# Altium schematic sheet Power.SchDoc
size A
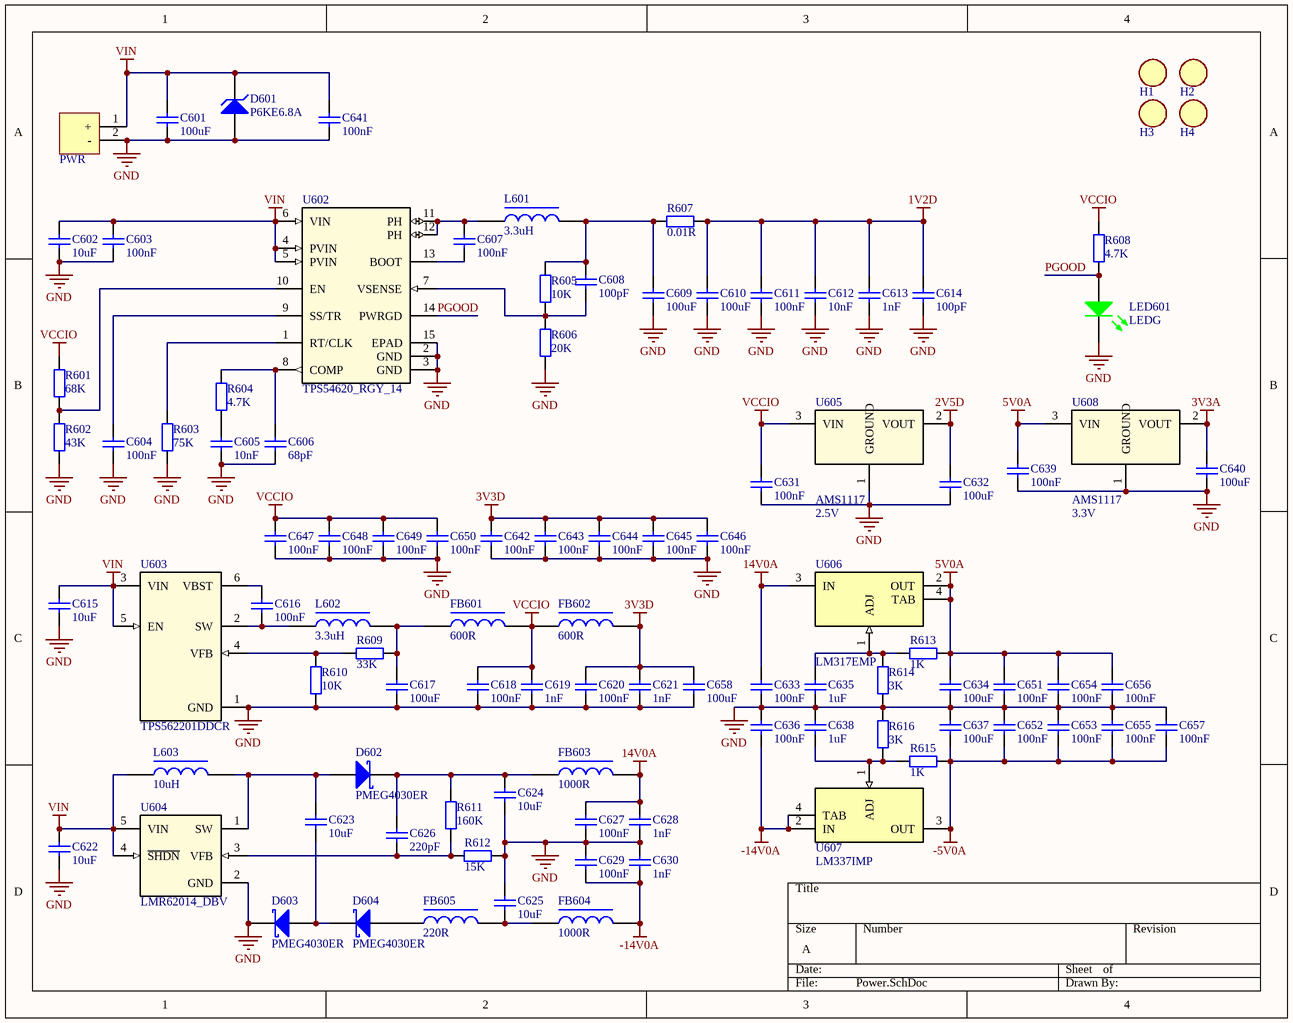
[diagram p0: Power.SchDoc]

## Parts
C601  value 100uF  [1210C]  (hidden comment: MLCC)
C602  value 10uF  [1206C]  (hidden comment: MLCC)
C603  value 100nF  [0603C]  (hidden comment: MLCC)
C604  value 100nF  [0603C]  (hidden comment: MLCC)
C605  value 10nF  [0603C]  (hidden comment: MLCC)
C606  value 68pF  [0603C]  (hidden comment: MLCC)
C607  value 100nF  [0603C]  (hidden comment: MLCC)
C608  value 100pF  [0603C]  (hidden comment: MLCC)
C609  value 100uF  [1206C]  (hidden comment: MLCC)
C610  value 100uF  [1206C]  (hidden comment: MLCC)
C611  value 100nF  [0402C]  (hidden comment: MLCC)
C612  value 10nF  [0402C]  (hidden comment: MLCC)
C613  value 1nF  [0402C]  (hidden comment: MLCC)
C614  value 100pF  [0402C]  (hidden comment: MLCC)
C615  value 10uF  [1206C]  (hidden comment: MLCC)
C616  value 100nF  [0603C]  (hidden comment: MLCC)
C617  value 100uF  [1206C]  (hidden comment: MLCC)
C618  value 100nF  [0402C]  (hidden comment: MLCC)
C619  value 1nF  [0402C]  (hidden comment: MLCC)
C620  value 100nF  [0402C]  (hidden comment: MLCC)
C621  value 1nF  [0402C]  (hidden comment: MLCC)
C622  value 10uF  [1206C]  (hidden comment: MLCC)
C623  value 10uF  [1206C]  (hidden comment: MLCC)
C624  value 10uF  [1206C]  (hidden comment: MLCC)
C625  value 10uF  [1206C]  (hidden comment: MLCC)
C626  value 220pF  [0603C]  (hidden comment: MLCC)
C627  value 100nF  [0402C]  (hidden comment: MLCC)
C628  value 1nF  [0402C]  (hidden comment: MLCC)
C629  value 100nF  [0402C]  (hidden comment: MLCC)
C630  value 1nF  [0402C]  (hidden comment: MLCC)
C631  value 100nF  [0603C]  (hidden comment: MLCC)
C632  value 100uF  [1206C]  (hidden comment: MLCC)
C633  value 100nF  [0603C]  (hidden comment: MLCC)
C634  value 100uF  [1206C]  (hidden comment: MLCC)
C635  value 1uF  [0805C]  (hidden comment: MLCC)
C636  value 100nF  [0603C]  (hidden comment: MLCC)
C637  value 100uF  [1206C]  (hidden comment: MLCC)
C638  value 1uF  [0805C]  (hidden comment: MLCC)
C639  value 100nF  [0603C]  (hidden comment: MLCC)
C640  value 100uF  [1206C]  (hidden comment: MLCC)
C641  value 100nF  [0603C]  (hidden comment: MLCC)
C642  value 100nF  [0603C]  (hidden comment: MLCC)
C643  value 100nF  [0603C]  (hidden comment: MLCC)
C644  value 100nF  [0603C]  (hidden comment: MLCC)
C645  value 100nF  [0603C]  (hidden comment: MLCC)
C646  value 100nF  [0603C]  (hidden comment: MLCC)
C647  value 100nF  [0603C]  (hidden comment: MLCC)
C648  value 100nF  [0603C]  (hidden comment: MLCC)
C649  value 100nF  [0603C]  (hidden comment: MLCC)
C650  value 100nF  [0603C]  (hidden comment: MLCC)
C651  value 100nF  [0603C]  (hidden comment: MLCC)
C652  value 100nF  [0603C]  (hidden comment: MLCC)
C653  value 100nF  [0603C]  (hidden comment: MLCC)
C654  value 100nF  [0603C]  (hidden comment: MLCC)
C655  value 100nF  [0603C]  (hidden comment: MLCC)
C656  value 100nF  [0603C]  (hidden comment: MLCC)
C657  value 100nF  [0603C]  (hidden comment: MLCC)
C658  value 100uF  [1206C]  (hidden comment: MLCC)
D601  P6KE6.8A  [SMB]
D602  PMEG4030ER  [SOD123]
D603  PMEG4030ER  [SOD123]
D604  PMEG4030ER  [SOD123]
FB601  value 600R  [1206L]  (hidden comment: FerriteBead)
FB602  value 600R  [1206L]  (hidden comment: FerriteBead)
FB603  value 1000R  [0805L]  (hidden comment: FerriteBead)
FB604  value 1000R  [0805L]  (hidden comment: FerriteBead)
FB605  value 220R  [0805L]  (hidden comment: FerriteBead)
H1  MountHole  [MOUNTHOLE]  (value not drawn)
H2  MountHole  [MOUNTHOLE]  (value not drawn)
H3  MountHole  [MOUNTHOLE]  (value not drawn)
H4  MountHole  [MOUNTHOLE]  (value not drawn)
L601  value 3.3uH  [IND0630]  (hidden comment: PowerInductor)
L602  value 3.3uH  [IND0420]  (hidden comment: PowerInductor)
L603  value 10uH  [IND0420]  (hidden comment: PowerInductor)
LED601  LEDG  [LED1206G]
PWR  WPORT2_PWR  [VH3.96-POWER-2P]  (value not drawn)
R601  value 68K  [0603R]  (hidden comment: Resistor)
R602  value 43K  [0603R]  (hidden comment: Resistor)
R603  value 75K  [0603R]  (hidden comment: Resistor)
R604  value 4.7K  [0603R]  (hidden comment: Resistor)
R605  value 10K  [0603R]  (hidden comment: Resistor)
R606  value 20K  [0603R]  (hidden comment: Resistor)
R607  value 0.01R  [1206R]  (hidden comment: Resistor)
R608  value 4.7K  [0603R]  (hidden comment: Resistor)
R609  value 33K  [0603R]  (hidden comment: Resistor)
R610  value 10K  [0603R]  (hidden comment: Resistor)
R611  value 160K  [0603R]  (hidden comment: Resistor)
R612  value 15K  [0603R]  (hidden comment: Resistor)
R613  value 1K  [0603R]  (hidden comment: Resistor)
R614  value 3K  [0603R]  (hidden comment: Resistor)
R615  value 1K  [0603R]  (hidden comment: Resistor)
R616  value 3K  [0603R]  (hidden comment: Resistor)
U602  TPS54620_RGY_14  [RGY14_2P05X2P05]
U603  TPS562201DDCR  [DDC0006A_N]
U604  LMR62014_DBV  [MF05A_N]
U605  AMS1117  value 2.5V  [DCY4]
U606  LM317EMP  [MP04A_N]
U607  LM337IMP  [MP04A_N]
U608  AMS1117  value 3.3V  [DCY4]

## Nets
1V2D: C610.2 C611.2 C612.2 C613.2 C614.2 R607.2
2V5D: C632.2 U605.2(VOUT)
3V3A: C640.2 U608.2(VOUT)
3V3D: C620.2 C621.2 C642.2 C643.2 C644.2 C645.2 C646.2 C658.2 FB602.2
5V0A: C634.2 C639.2 C651.2 C654.2 C656.2 R613.2 U606.2(OUT) U606.4(TAB) U608.3(VIN)
14V0A: C627.2 C628.2 C633.2 FB603.2 U606.3(IN)
-5V0A: C637.1 C652.1 C653.1 C655.1 C657.1 R615.2 U607.3(OUT)
-14V0A: C629.1 C630.1 C636.1 FB604.2 U607.2(IN) U607.4(TAB)
GND: C601.1 C602.1 C603.1 C604.1 C605.1 C606.1 C609.1 C610.1 C611.1 C612.1 C613.1 C614.1 C615.1 C617.1 C618.1 C619.1 C620.1 C621.1 C622.1 C624.1 C625.2 C627.1 C628.1 C629.2 C630.2 C631.1 C632.1 C633.1 C634.1 C635.1 C636.2 C637.2 C638.2 C639.1 C640.1 C641.1 C642.1 C643.1 C644.1 C645.1 C646.1 C647.1 C648.1 C649.1 C650.1 C651.1 C652.2 C653.2 C654.1 C655.2 C656.1 C657.2 C658.1 D601.1(A) D603.2(K) LED601.2(K) PWR.2(-) R602.1 R603.1 R606.1 R610.1 R612.2 R614.1 R616.2 U602.2(GND) U602.3(GND) U602.15(EPAD) U603.1(GND) U604.2(GND) U605.1(GROUND) U608.1(GROUND)
VCCIO: C618.2 C619.2 C631.2 C647.2 C648.2 C649.2 C650.2 FB601.2 FB602.1 R601.2 R608.2 U605.3(VIN)
VIN: C601.2 C602.2 C603.2 C615.2 C622.2 C641.2 D601.2(K) L603.1 PWR.1(+) U602.4(PVIN) U602.5(PVIN) U602.6(VIN) U603.3(VIN) U603.5(EN) U604.4(~{SHDN}) U604.5(VIN)
PGOOD: LED601.1(A) R608.1 U602.14(PWRGD)
NetC604_2: C604.2 U602.9(SS/TR)
NetC605_2: C605.2 R604.1
NetC606_2: C606.2 R604.2 U602.8(COMP)
NetC607_1: C607.1 U602.13(BOOT)
NetC607_2: C607.2 L601.1 U602.11(PH) U602.12(PH)
NetC608_1: C608.1 R605.1 R606.2 U602.7(VSENSE)
NetC608_2: C608.2 C609.2 L601.2 R605.2 R607.1
NetC616_1: C616.1 L602.1 U603.2(SW)
NetC616_2: C616.2 U603.6(VBST)
NetC617_2: C617.2 FB601.1 L602.2 R609.2
NetC623_1: C623.1 D603.1(A) D604.2(K)
NetC623_2: C623.2 D602.1(A) L603.2 U604.1(SW)
NetC624_2: C624.2 C626.2 D602.2(K) FB603.1 R611.2
NetC625_1: C625.1 FB604.1 FB605.2
NetC626_1: C626.1 R611.1 R612.1 U604.3(VFB)
NetC635_2: C635.2 R613.1 R614.2 U606.1(ADJ)
NetC638_1: C638.1 R615.1 R616.1 U607.1(ADJ)
NetD604_1: D604.1(A) FB605.1
NetR601_1: R601.1 R602.2 U602.10(EN)
NetR603_2: R603.2 U602.1(RT/CLK)
NetR609_1: R609.1 R610.2 U603.4(VFB)

## Library data of the parts
D601 = P6KE6.8A: 600 Watt Peak Power Surmetict-40 Zener TransientVoltage Suppressors
D602-D604 = PMEG4030ER: 3 A low VF MEGA Schottky barrier rectifier
H1-H4 = MountHole: 3mm mount hole
L601-L603 = PowerInductor: Power Inductor
LED601 = LEDG: GREEN LED
PWR = WPORT2_PWR: 2 pin power port
U602 = TPS54620_RGY_14: Buck Step Down Regulator with 4.5 to 17 V Input and 0.8 to 15 V Output, -40 to 150 degC, 14-Pin VQFN (RGY), Green (RoHS & no Sb/Br); Vendor: Texas Instruments; PIN_COUNT: 14; FAMILY_NAME: STEP-DOWN REGULATOR; Manufacturer_Part_Number: tps54620_rgy_14; GENERIC_PART_NUMBER: TPS54620; Manufacturer: Texas Instruments; PACKAGE_DESIGNATOR: RGY; INDUSTRY_STD_PKG_TYPE: VQFN; Datasheet_URL: http://www.ti.com/lit/gpn/TPS54620; Value: Value; Type: Type; RefDes: RefDes
U603 = TPS562201DDCR: 4.5-V to 17-V Input, 2-A Synchronous Step-Down Voltage Regulator in 6-Pin SOT-23; Manufacturer: Texas Instruments; CompType: IC; PIN_COUNT: 6; Application_BuildNumber: *; PartNumber: TPS562201DDCR; PackageReference: DDC0006A; MountType: SMT; RefDes: RefDes; TYPE: TYPE; Value: Value
U604 = LMR62014_DBV: SIMPLE SWITCHER® 20Vout, 1.4A Step-Up Voltage Regulator in SOT-23; Manufacturer: Texas Instruments; CompType: IC; PIN_COUNT: 5; Application_BuildNumber: *; PartNumber: LMR62014_DBV; PackageReference: MF05A; MountType: SMT; RefDes: RefDes; TYPE: TYPE; Value: Value
U605 U608 = AMS1117: 800mA LOW DROPOUT VOLTAGE REGULATOR
U606 = LM317EMP: 3-Terminal Adjustable Regulator, 4-pin SOT-223; Manufacturer: National Semiconductor; PackageTopMarking: XYTT*N01A; PowerWise: N; CompType: LDO IC; High-Reliability: Y; DatasheetVersion: Apr-2007; PackageVersion: revB, Apr-2003; PackageReference: MP04A; PackageDescription: Molded SOT-223, 6.50 x 3.56 x 1.6mm Body, 4 Lead, 2.3mm Pitch; PartNumber: LM317EMP; RoHS: N; PinCount: 4; Code_JEDEC: TO-261-AA; Code_IPC: SOT223-4; ComponentLink1Description: Manufacturer URL; ComponentLink1URL: http://www.national.com/; ComponentLink2Description: LM317 Datasheet; ComponentLink2URL: http://www.national.com/ds/LM/LM317.pdf; ComponentLink3Description: LM317 Web Page; ComponentLink3URL: http://www.national.com/pf/LM/LM317.html; ComponentLink4Description: MP04A Package Page; ComponentLink4URL: http://www.national.com/packaging/folders/mp04a.html
U607 = LM337IMP: 3-Terminal Adjustable Negative Regulator, 4-pin SOT-223; Manufacturer: National Semiconductor; PackageTopMarking: XYTT*N02A; PowerWise: N; CompType: LDO IC; High-Reliability: Y; DatasheetVersion: Nov-2004; PackageVersion: revB, Apr-2003; PackageReference: MP04A; PackageDescription: Molded SOT-223, 6.50 x 3.56 x 1.6mm Body, 4 Lead, 2.3mm Pitch; PartNumber: LM337IMP; RoHS: N; PinCount: 4; Code_JEDEC: TO-261-AA; Code_IPC: SOT223-4; ComponentLink1Description: Manufacturer URL; ComponentLink1URL: http://www.national.com/; ComponentLink2Description: LM337 Datasheet; ComponentLink2URL: http://www.national.com/ds/LM/LM337.pdf; ComponentLink3Description: LM337 Web Page; ComponentLink3URL: http://www.national.com/pf/LM/LM337.html; ComponentLink4Description: MP04A Package Page; ComponentLink4URL: http://www.national.com/packaging/folders/mp04a.html